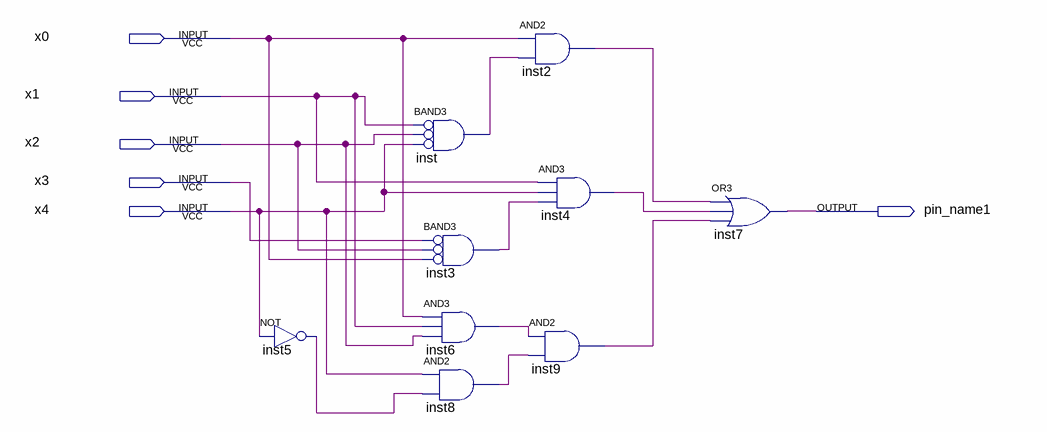
[diagram p0: schematic sheet]
// Quartus schematic mode1_logic.bdf as structural Verilog: 9 symbols, 6 pins
module mode1_logic (
  input  x0,
  input  x1,
  input  x2,
  input  x3,
  input  x4,
  output pin_name1
);

  wire inst2_out, inst3_out, inst4_out, inst5_out, inst6_out, inst8_out, inst9_out, inst_out;

  not inst5 (inst5_out, x4);
  and inst (inst_out, ~x1, ~x2, ~x4);  // BAND3
  and inst3 (inst3_out, ~x3, ~x2, ~x0);  // BAND3
  and inst6 (inst6_out, x0, x1, x2);
  and inst8 (inst8_out, x4, inst5_out);
  and inst2 (inst2_out, x0, inst_out);
  and inst4 (inst4_out, x1, x4, inst3_out);
  and inst9 (inst9_out, inst6_out, inst8_out);
  or inst7 (pin_name1, inst2_out, inst4_out, inst9_out);
endmodule
